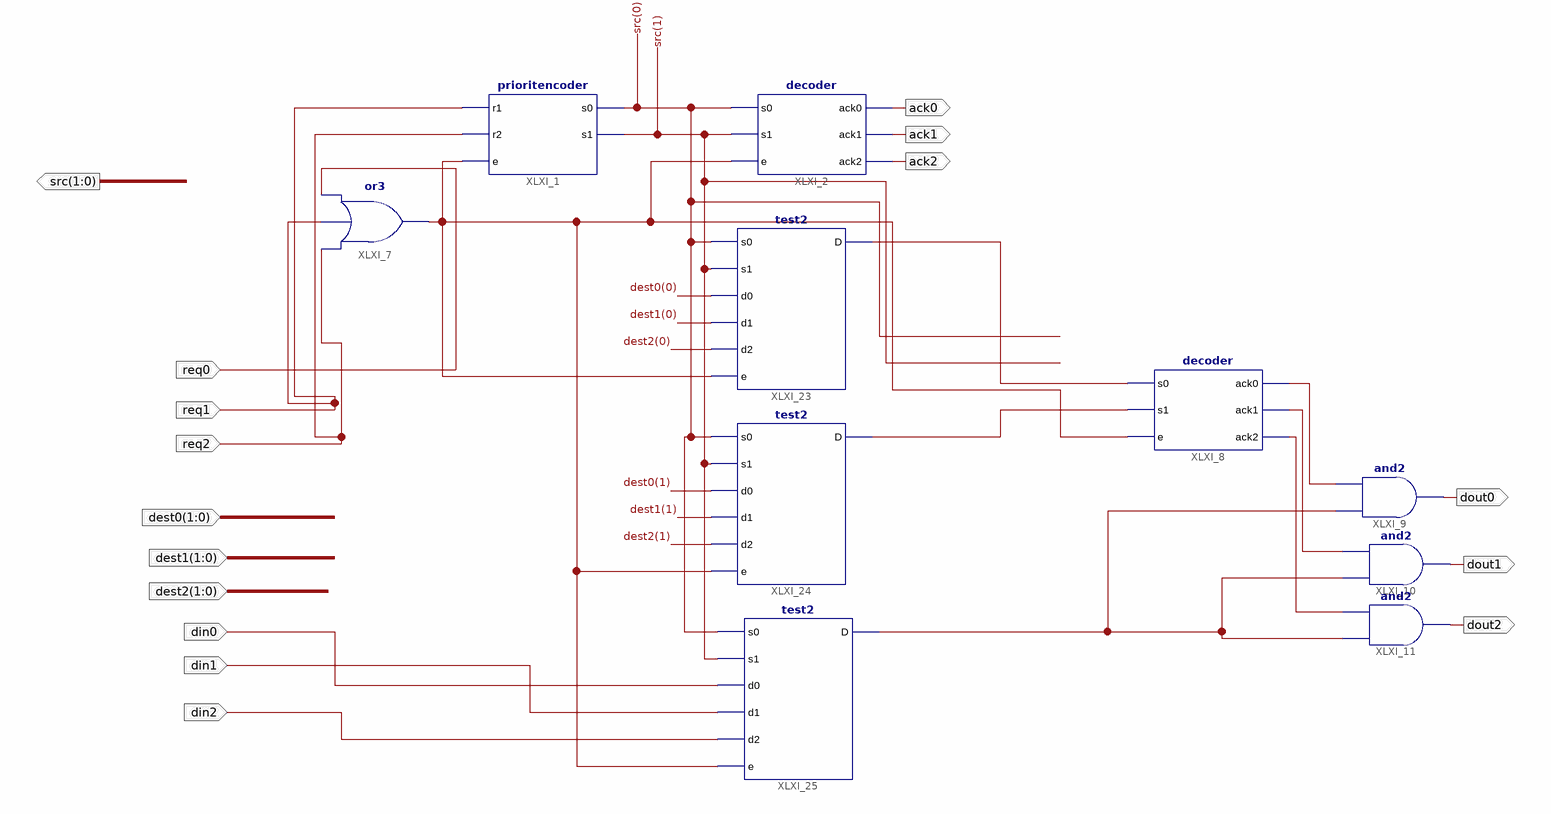
[diagram p0: schematic sheet 1]
// Xilinx ISE schematic lab2_port_switch.sch (artix7) as structural Verilog: 10 symbols, 16 ports
module lab2_port_switch (
  input  req0,
  input  req1,
  input  req2,
  input  [1:0] dest0,
  input  [1:0] dest1,
  input  [1:0] dest2,
  input  din0,
  input  din1,
  input  din2,
  output ack0,
  output ack1,
  output ack2,
  output dout0,
  output dout1,
  output dout2,
  output [1:0] src
);

  wire XLXN_42, XLXN_43, XLXN_44, XLXN_46, XLXN_47, XLXN_48, XLXN_49;

  prioritencoder XLXI_1 (.e(XLXN_44), .r1(req1), .r2(req2), .s0(src[0]), .s1(src[1]));
  decoder XLXI_2 (.ack0(ack0), .ack1(ack1), .ack2(ack2), .e(XLXN_44), .s0(src[0]), .s1(src[1]));
  or XLXI_7 (XLXN_44, req2, req1, req0);
  decoder XLXI_8 (.ack0(XLXN_46), .ack1(XLXN_47), .ack2(XLXN_48), .e(XLXN_44), .s0(XLXN_42), .s1(XLXN_43));
  and XLXI_9 (dout0, XLXN_49, XLXN_46);
  and XLXI_10 (dout1, XLXN_49, XLXN_47);
  and XLXI_11 (dout2, XLXN_49, XLXN_48);
  test2 XLXI_23 (.D(XLXN_42), .d0(dest0[0]), .d1(dest1[0]), .d2(dest2[0]), .e(XLXN_44), .s0(src[0]), .s1(src[1]));
  test2 XLXI_24 (.D(XLXN_43), .d0(dest0[1]), .d1(dest1[1]), .d2(dest2[1]), .e(XLXN_44), .s0(src[0]), .s1(src[1]));
  test2 XLXI_25 (.D(XLXN_49), .d0(din0), .d1(din1), .d2(din2), .e(XLXN_44), .s0(src[0]), .s1(src[1]));
endmodule
